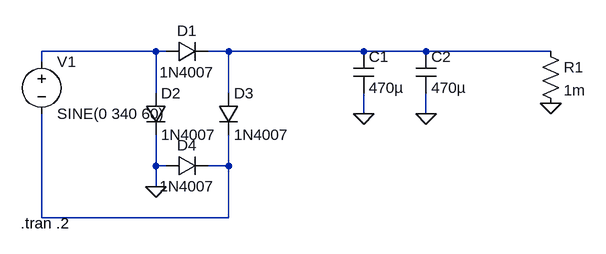
[diagram p0: schematic DC-Power.asc]
DC-Power.asc, the LTspice schematic file:
Version 4.1
SHEET 1 880 680
WIRE 128 64 -48 64
WIRE 144 64 128 64
WIRE 240 64 208 64
WIRE 448 64 240 64
WIRE 544 64 448 64
WIRE 736 64 544 64
WIRE -48 80 -48 64
WIRE 128 128 128 64
WIRE 240 128 240 64
WIRE 448 160 448 128
WIRE 544 160 544 128
WIRE 128 240 128 192
WIRE 144 240 128 240
WIRE 240 240 240 192
WIRE 240 240 208 240
WIRE 128 272 128 240
WIRE -48 320 -48 160
WIRE 240 320 240 240
WIRE 240 320 -48 320
FLAG 128 272 0
FLAG 448 160 0
FLAG 544 160 0
FLAG 736 144 0
SYMBOL voltage -48 64 R0
WINDOW 123 0 0 Left 0
WINDOW 39 0 0 Left 0
SYMATTR InstName V1
SYMATTR Value SINE(0 340 60)
SYMBOL diode 144 80 R270
WINDOW 0 32 32 VTop 2
WINDOW 3 0 32 VBottom 2
SYMATTR InstName D1
SYMATTR Value 1N4007
SYMBOL diode 112 128 R0
SYMATTR InstName D2
SYMATTR Value 1N4007
SYMBOL diode 224 128 R0
SYMATTR InstName D3
SYMATTR Value 1N4007
SYMBOL diode 144 256 R270
WINDOW 0 32 32 VTop 2
WINDOW 3 0 32 VBottom 2
SYMATTR InstName D4
SYMATTR Value 1N4007
SYMBOL cap 432 64 R0
SYMATTR InstName C1
SYMATTR Value 470µ
SYMBOL cap 528 64 R0
SYMATTR InstName C2
SYMATTR Value 470µ
SYMBOL res 720 48 R0
SYMATTR InstName R1
SYMATTR Value 1m
TEXT -80 328 Left 2 !.tran .2

The netlist it stands for:
* DC-Power.asc
V1 N001 N003 SINE(0 340 60)
D1 N001 N002 1N4007
D2 N001 0 1N4007
D3 N002 N003 1N4007
D4 0 N003 1N4007
C1 N002 0 470µ
C2 N002 0 470µ
R1 N002 0 1m
.model D D
.lib standard.dio
.tran .2
.backanno
.end